# Altium schematic sheet TCAN1146_PINOUT.SchDoc
size A4; SheetNumber: 9; SheetTotal: 10
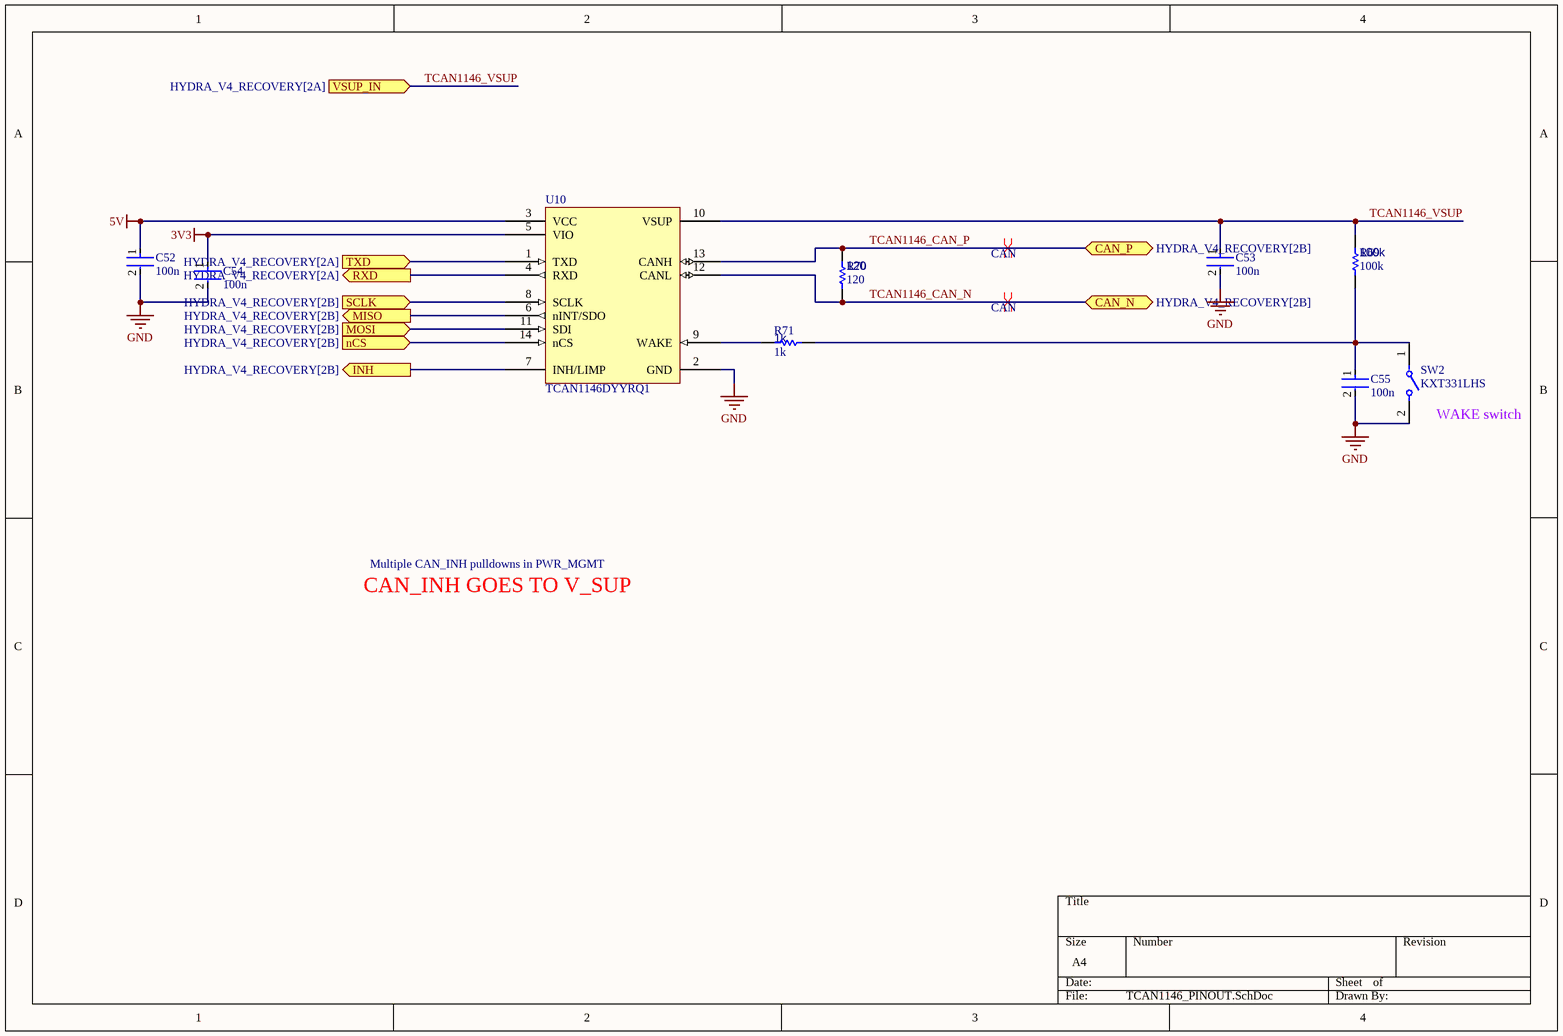
[diagram p0: TCAN1146_PINOUT.SchDoc]

## Parts
C52  100n  [FP-0402-L_1_0_0_05-W_0_5-IPC_A]
C53  100n  [FP-0402-L_1_0_0_05-W_0_5-IPC_A]
C54  100n  [FP-0402-L_1_0_0_05-W_0_5-IPC_A]
C55  100n  [FP-0402-L_1_0_0_05-W_0_5-IPC_A]
R69  100k  [R0603B]
R70  120  [R0603B]
R71  1k  [R0603B]
SW2  KXT331LHS  [FP-KXT331LHS-MFG]
U10  TCAN1146DYYRQ1  [TCAN1146DYYRQ1-Footprint-1]

## Ports
CAN_N (bidir, see HYDRA_V4_RECOVERY[2B]), CAN_P (bidir, see HYDRA_V4_RECOVERY[2B]), INH (out, see HYDRA_V4_RECOVERY[2B]), MISO (out, see HYDRA_V4_RECOVERY[2B]), MOSI (in, see HYDRA_V4_RECOVERY[2B]), nCS (in, see HYDRA_V4_RECOVERY[2B]), RXD (out, see HYDRA_V4_RECOVERY[2A]), SCLK (in, see HYDRA_V4_RECOVERY[2B]), TXD (in, see HYDRA_V4_RECOVERY[2A]), VSUP_IN (in, see HYDRA_V4_RECOVERY[2A])

## Nets
3V3: C54.1 U10.5(VIO)
5V: C52.1 U10.3(VCC)
GND: C52.2 C53.2 C54.2 C55.2 SW2.2 U10.2(GND)
INH: U10.7(INH/LIMP) ; port INH
MISO: U10.6(nINT/SDO) ; port MISO
MOSI: U10.11(SDI) ; port MOSI
nCS: U10.14(nCS) ; port nCS
RXD: U10.4(RXD) ; port RXD
SCLK: U10.8(SCLK) ; port SCLK
TCAN1146_CAN_N: R70.1 U10.12(CANL) ; port CAN_N
TCAN1146_CAN_P: R70.2 U10.13(CANH) ; port CAN_P
TCAN1146_VSUP: C53.1 R69.2 U10.10(VSUP) ; port VSUP_IN
TXD: U10.1(TXD) ; port TXD
NetC55_1: C55.1 R69.1 R71.1 SW2.1
NetR71_2: R71.2 U10.9(WAKE)

## Layout directives
differential pair; differential pair class CAN: TCAN1146_CAN_N, TCAN1146_CAN_P

## Notes on the sheet
- (near SW2) WAKE switch
- Multiple CAN_INH pulldowns in PWR_MGMT
- CAN_INH GOES TO V_SUP

## Library data of the parts
C52-C55 = CMP-001-00058-1: LARGE PADS, 0402 CAP, CHANGE COMMENT TO MATCH REAL P/N; Capacitor Type: Ceramic; Value: 100n; Min Operating Temperature: -55°C; Mounting Technology: Surface Mount; Pins: 2; Case/Package: 0402; RoHS Compliant: Yes; Max Operating Temperature: 85°C
R69-R71 = CMP-009-00002-14: Resistor
  R69: Value: 100k
  R70: Value: 120
  R71: Value: 1k
SW2 = CMP-10040-000029-1: SWITCH TACTILE SPST-NO 0.02A 15V; Operating Force: 240gf; Switch Travel: 0.13mm; Illumination Type: Non-Illuminated; Throw Configuration: SPST; Number of Ports: 1; Current Rating: 5A; Mechanical Life: 500000Cycles; Switch Function: Off-Mom; Connector Type: USB; Actuator Type: Standard; Gender: Receptacle; Number of Contacts: 24; Contact Plating: Gold; Insulation Color: Black; Min Operating Temperature: -40°C; Packaging: Tape and Reel; Flammability Rating: UL94 V-0; Max Operating Temperature: 85°C; Termination: Solder; Mount: Surface Mount
U10 = CMP-318-000000-2: Automotive CAN FD transceiver with watchdog, bus diagnostics and partial networking via sele 14-SOT-23-THIN -40 to 150; Component Type: Standard; Design Item ID: CMP-015-00012-2; Pin Count: 14; Source: TCAN1146DYYRQ1.SchLib